# EAGLE schematic authenticator_breakout (EAGLE 6.3)
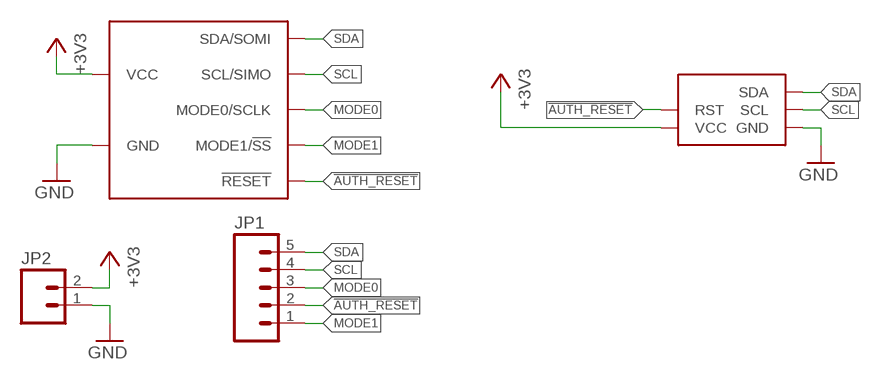
[diagram p0: schematic, sheet 1]

## Parts
JP1  M05LOCK  [1X05_LOCK]
JP2  M02LOCK  [1X02_LOCK]
U$2  AUTHENTICATORQFN  [AUTH_QFN20]
U$4  AUTHENTICATOR_2C  [AUTH_SQC]

## Nets
!AUTH_RESET: JP1.2 U$2.P$4(!RESET) U$4.P$7(RST)
+3V3: JP2.2 U$2.P$5(VCC) U$4.P$8(VCC)
GND: JP2.1 U$2.P$11(GND) U$4.P$1(GND)
MODE0: JP1.3 U$2.P$14(MODE0/SCLK)
MODE1: JP1.1 U$2.P$2(MODE1/!SS)
SCL: JP1.4 U$2.P$12(SCL/SIMO) U$4.P$6(SCL)
SDA: JP1.5 U$2.P$13(SDA/SOMI) U$4.P$2(SDA)

## Library data of the parts
JP1 = SparkFun-Connectors:M05: Header 5 Standard 5-pin 0.1" header. Use with straight break away headers (SKU : PRT-00116), right angle break away headers (PRT-00553), swiss pins (PRT-00743), machine pins (PRT-00117), and female headers (PRT-00115). Molex polarized connector foot print use with SKU : PRT-08230 with associated crimp pins and housings.
JP2 = SparkFun-Connectors:M02: Header 2 Standard 2-pin 0.1" header. Use with straight break away headers (SKU : PRT-00116), right angle break away headers (PRT-00553), swiss pins (PRT-00743), machine pins (PRT-00117), and female headers (PRT-00115). Molex polarized connector foot print use with SKU : PRT-08233 with associated crimp pins and housings.
U$2 = corona:AUTHENTICATOR
U$4 = corona:AUTHENTICATOR_2C